# EAGLE design BiphasicBoardv2 (EAGLE 6.5.0)
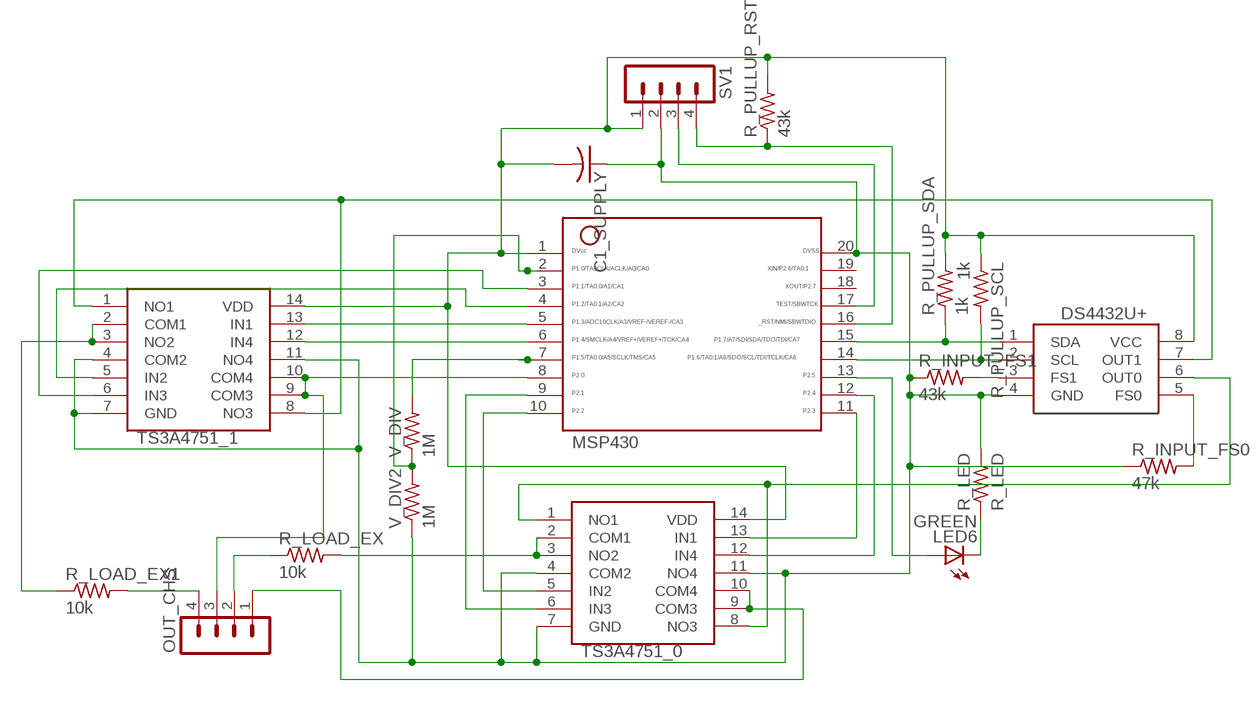
[diagram p0: schematic, sheet 1]

## Parts
C1_SUPPLY  C-USC0603  [C0603]
DS4432U+  DS4432U+  [8_PIN]
LED6  GREEN  LED1206  [LED-1206]
MSP430  MSP430  [20_PIN]
OUT_CHS  MA04-1  [MA04-1]
R_INPUT_FS0  47k  R-US_R0603  [R0603]
R_INPUT_FS1  43k  R-US_R0603  [R0603]
R_LED  R_LED  R-US_R0603  [R0603]
R_LOAD_EX  10k  R-US_R0603  [R0603]
R_LOAD_EX1  10k  R-US_R0603  [R0603]
R_PULLUP_RST  43k  R-US_R0603  [R0603]
R_PULLUP_SCL  1k  R-US_R0603  [R0603]
R_PULLUP_SDA  1k  R-US_R0603  [R0603]
SV1  MA04-1  [MA04-1]
TS3A4751_0  TS3A4751  [14_PIN]
TS3A4751_1  TS3A4751  [14_PIN]
V_DIV  1M  R-US_R0603  [R0603]
V_DIV2  1M  R-US_R0603  [R0603]

## Nets
_RST: MSP430.16 R_PULLUP_RST.1 SV1.4
CURRENT0: DS4432U+.6(OUT0) TS3A4751_0.1(NO1) TS3A4751_0.8(NO3)
DAC_OUT1: DS4432U+.7(OUT1) TS3A4751_1.1(NO1) TS3A4751_1.8(NO3)
GND: C1_SUPPLY.1 DS4432U+.4(GND) MSP430.20 R_INPUT_FS0.1 R_INPUT_FS1.1 R_LED.2 SV1.2 TS3A4751_0.4(COM2) TS3A4751_0.7(GND) TS3A4751_0.11(NO4) TS3A4751_1.4(COM2) TS3A4751_1.7(GND) TS3A4751_1.11(NO4) V_DIV2.1
IN1: MSP430.11 TS3A4751_0.13(IN1)
IN1_1: MSP430.5 TS3A4751_1.13(IN1)
IN2_0: MSP430.10 TS3A4751_0.5(IN2)
IN2_1: MSP430.4 TS3A4751_1.5(IN2)
IN3_0: MSP430.9 TS3A4751_0.6(IN3)
IN3_1: MSP430.3 TS3A4751_1.6(IN3)
IN4: MSP430.12 TS3A4751_0.12(IN4)
IN4_1: MSP430.6 TS3A4751_1.12(IN4)
LOAD1_0: R_LOAD_EX.2 TS3A4751_0.2(COM1) TS3A4751_0.3(NO2)
LOAD1_1: R_LOAD_EX1.1 TS3A4751_1.2(COM1) TS3A4751_1.3(NO2)
LOAD2_0: OUT_CHS.1 TS3A4751_0.9(COM3) TS3A4751_0.10(COM4)
LOAD2_1: MSP430.8 OUT_CHS.3 TS3A4751_1.9(COM3) TS3A4751_1.10(COM4)
N$1: DS4432U+.2(SCL) MSP430.14 R_PULLUP_SCL.2
N$2: DS4432U+.1(SDA) MSP430.15 R_PULLUP_SDA.1
N$3: OUT_CHS.4 R_LOAD_EX1.2
N$4: OUT_CHS.2 R_LOAD_EX.1
N$5: LED6.A MSP430.13
N$6: MSP430.7 V_DIV.2
N$7: MSP430.2 V_DIV2.2 V_DIV.1
N$8: DS4432U+.5(FS0) R_INPUT_FS0.2
N$9: LED6.C R_LED.1
TEST: MSP430.17 SV1.3
VDD: C1_SUPPLY.2 DS4432U+.8(VCC) MSP430.1 R_PULLUP_RST.2 R_PULLUP_SCL.1 R_PULLUP_SDA.2 SV1.1 TS3A4751_0.14(VDD) TS3A4751_1.14(VDD)
VIA1: DS4432U+.3(FS1) R_INPUT_FS1.2
Unconnected: MSP430.18 MSP430.19

## Library data of the parts
C1_SUPPLY = resistor:C-US: CAPACITOR, American symbol
DS4432U+ = BiphasicBoard:DS4432U+: DS4432U+ current DAC
LED6 = SparkFun-LED:LED: LEDs Standard schematic elements and footprints for 5mm, 3mm, 1206, and 0603 sized LEDs. 5mm - Spark Fun Electronics SKU : COM-00529 (and others)
MSP430 = BiphasicBoard:MSP430: MSP430 20 pins
OUT_CHS SV1 = BiphasicBoard:MA04-1: PIN HEADER; OC_FARNELL: unknown; OC_NEWARK: unknown
R_INPUT_FS0 R_INPUT_FS1 R_LED R_LOAD_EX R_LOAD_EX1 R_PULLUP_RST R_PULLUP_SCL R_PULLUP_SDA V_DIV V_DIV2 = BiphasicBoard:R-US_: RESISTOR, American symbol
TS3A4751_0 TS3A4751_1 = BiphasicBoard:TS3A4751: TS3A4751 Quad Switch

## Board
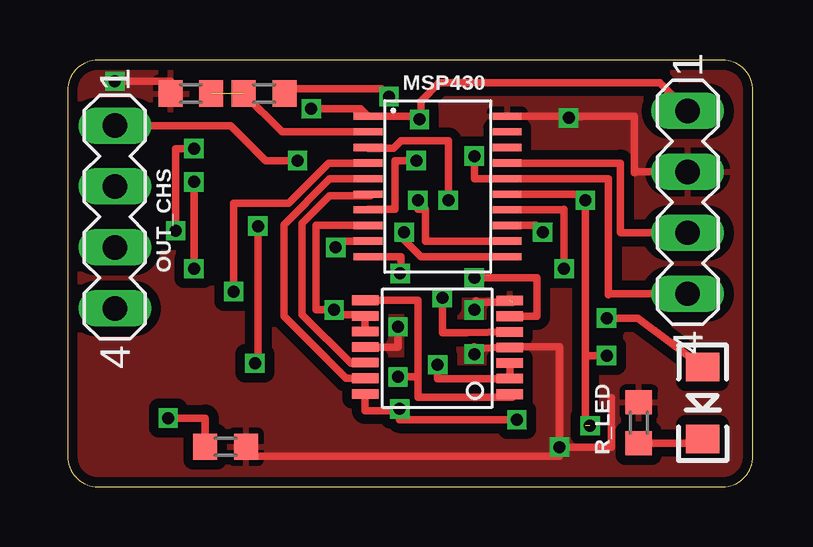
[diagram p1: board, top side]
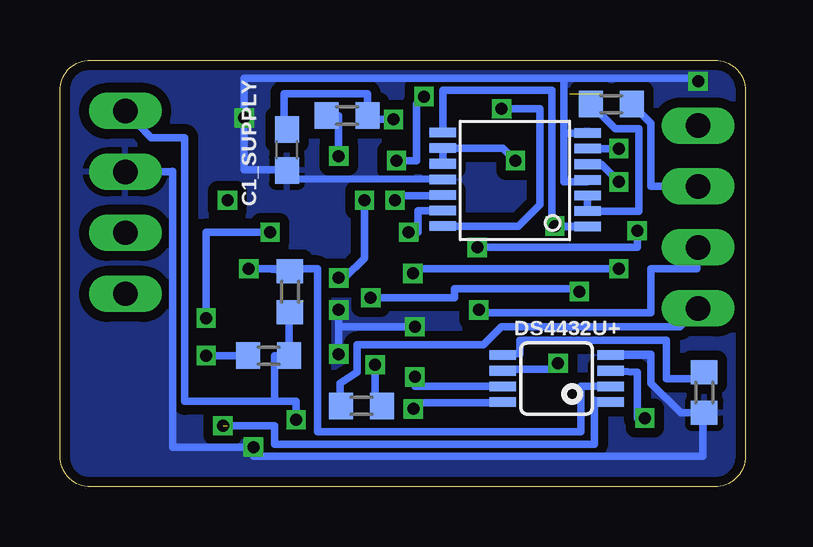
[diagram p2: board, bottom side, seen from below]

Size 28.57 x 17.78 mm. Coordinates in mm from the lower left corner, seen from the top.
Outline: 0,16.51 0,1.27 arc90 1.27,0 27.3,0 arc90 28.57,1.27 28.57,16.51 arc90 27.3,17.78 1.27,17.78 arc90 0,16.51
Copper layers (1*16): Top 0.035mm / dielectric 1.5mm / Bottom 0.035mm
Design rules "Seeed_DRU": minimum track width 6mil, minimum drill 12mil, track to track 6mil, track to pad 6mil, pad to pad 6mil, via to via 6mil, smd to smd 0mil, copper to edge 10mil, drill to drill 10mil, minimum pad ring 10mil, minimum via ring 6mil, stop-mask expansion 2mil, vias tented up to drill 100mil, thermal gap 10mil

### Footprints (pad centres in the part's own frame; a part is rotated, then mirrored left to right if it is on the bottom)
C0603 = smd 1.1 x 1: 1 -0.85,0; 2 0.85,0
8_PIN = smd 1.1 x 0.4: 1 -2.25,0.975; 2 -2.25,0.325; 3 -2.25,-0.325; 4 -2.25,-0.975; 5 2.25,-0.975; 6 2.25,-0.325; 7 2.25,0.325; 8 2.25,0.975
LED-1206 = smd 1.2 x 1.4: A -1.5,0; C 1.5,0
20_PIN = smd 0.3 x 1.2: 1 -2.925,-2.9; 2 -2.275,-2.9; 3 -1.625,-2.9; 4 -0.975,-2.9; 5 -0.325,-2.9; 6 0.325,-2.9; 7 0.975,-2.9; 8 1.625,-2.9; 9 2.275,-2.9; 10 2.925,-2.9; 11 2.925,2.9; 12 2.275,2.9; 13 1.625,2.9; 14 0.975,2.9; 15 0.325,2.9; 16 -0.325,2.9; 17 -0.975,2.9; 18 -1.625,2.9; 19 -2.275,2.9; 20 -2.925,2.9
MA04-1 = drill 1.016 long: 1 -3.81,0; 2 -1.27,0; 3 1.27,0; 4 3.81,0
R0603 = smd 1 x 1.1: 1 -0.85,0; 2 0.85,0
14_PIN = smd 1.1 x 0.4: 1 -3.26,1.165; 2 -3.26,0.515; 3 -3.26,-0.135; 4 -3.26,-0.785; 5 -3.26,-1.435; 6 -3.26,-2.085; 7 -3.26,-2.735; 8 2.77,-2.755; 9 2.77,-2.105; 10 2.77,-1.455; 11 2.77,-0.805; 12 2.77,-0.155; 13 2.77,0.495; 14 2.77,1.145

### Placement (x,y rotation side)
C1_SUPPLY  19.11,14.03 90 bottom
DS4432U+  7.87,4.51 180 bottom
LED6  26.48,3.49 270 top
MSP430  15.43,12.51 270 top
OUT_CHS  1.97,11.24 270 top
R_INPUT_FS0  1.72,3.92 90 bottom
R_INPUT_FS1  6.59,1.67 180 top
R_LED  23.81,2.67 90 top
R_LOAD_EX  5.59,15.94 180 bottom
R_LOAD_EX1  16,3.37 180 bottom
R_PULLUP_RST  16.61,15.47 0 bottom
R_PULLUP_SCL  18.99,8.13 90 bottom
R_PULLUP_SDA  19.88,5.46 0 bottom
SV1  25.85,11.85 270 top
TS3A4751_0  9.84,12 180 bottom
TS3A4751_1  15.18,5.02 180 top
V_DIV  8.19,16.38 0 top
V_DIV2  5.14,16.38 0 top

### Tracks (layer width: path | path; a pad name or v marks a point on that pad's centre or on a via)
_RST  (via drill 0.5)
  Top 0.305: v16.95,13.78 16.95,12.83 MSP430.16 22.54,12.84 22.54,8 22.58,8.04 SV1.4
  Bottom 0.305: R_PULLUP_RST.1 16.95,15.47 v16.95,13.78
CURRENT0  (via drill 0.5)
  Top 0.305: v7.94,10.86 7.94,5.14 v7.81,5.14
  Bottom 0.305: v7.94,10.86 8.06,10.86 8.06,16.51 12.61,16.51 TS3A4751_0.8 12.68,14.73 | v7.94,10.86 6.58,10.86 | v7.81,5.14 7.94,4.89 9.81,4.89 DS4432U+.6 | TS3A4751_0.1 7.94,10.84 v7.94,10.86
DAC_OUT1  (via drill 0.5)
  Top 0.305: 18.48,3.87 18.54,3.72 14.61,3.72 14.61,4.57 | 14.61,4.57 14.61,7.77 TS3A4751_1.8 12.38,7.77 12.38,7.81 | v13.78,4.57 14.61,4.57
  Top 0.406: TS3A4751_1.1 18.48,3.87
  Bottom 0.305: DS4432U+.7 13.78,4.18 v13.78,4.57
GND  (via drill 0.5)  (1 unrouted)
  Top 0.305: 16.95,5.78 TS3A4751_1.4 18.44,5.84 20.51,5.84 v20.51,1.65 | v16.95,5.52 16.83,5.67 | v16.95,7.37 17.02,7.37 17.02,7.68 | 17.02,7.68 18.56,7.68 | MSP430.20 21.72,15.43 | R_INPUT_FS1.1 7.43,1.54 7.43,1.27 20.51,1.27 v20.51,1.65 | v13.78,6.67 13.78,5.82 TS3A4751_1.11 | 21.72,15.43 23.62,15.43 23.62,13.08 23.66,13.12 SV1.2 | 21.72,15.43 v20.89,15.37 | 17.02,7.68 17.02,7.75 | v20.51,1.65 22.67,1.65 22.67,3.71 | V_DIV2.1 4.29,16.89 v1.97,16.89
  Top 0.406: 16.95,5.78 v16.95,5.52
  Bottom 0.305: 16.95,6.67 v16.95,7.37 | 4.06,5.52 5.62,5.52 DS4432U+.4 4.06,5.48 4.06,5.52 | v13.78,6.67 16.95,6.67 | 16.95,6.67 v16.95,5.52 | 1.78,3.11 1.72,3.11 R_INPUT_FS0.1 2.69,3.07 3.94,4.32 3.94,5.52 4.06,5.52 | TS3A4751_0.7 7.56,14.74 | TS3A4751_0.4 6.58,12.7 7.56,12.7 7.56,14.74 | TS3A4751_0.11 12.51,12.81 18.86,12.83 19.24,12.89 C1_SUPPLY.1 | C1_SUPPLY.1 18.99,13.21 20.89,13.21 v20.89,15.37 20.89,17.02 7.56,17.02 | 1.78,3.11 1.78,3.17 | 1.78,3.11 1.78,1.27 20.51,1.27 v20.51,1.65 23.88,1.65 23.88,13.12 | 7.56,14.74 7.56,17.02 | 19.18,13.21 C1_SUPPLY.1 | 23.88,13.14 23.88,13.12 | 23.88,13.12 SV1.2 | v1.97,16.89 1.97,17.02 7.56,17.02
  pour Top (isolate 0.406): -0.06,17.84 28.57,17.78 28.57,-0.06 0,0
  pour Bottom (isolate 0.406): -0.06,17.84 28.57,17.78 28.57,-0.06 0,0
IN1  (via drill 0.5)
  Top 0.305: v14.03,10.6 14.03,10.29 14.73,9.59 MSP430.11
  Bottom 0.305: TS3A4751_0.13 13.65,11.51 13.65,10.6 v14.03,10.6
IN1_1
  Top 0.305: MSP430.5 10.93,12.84 9.02,10.92 9.02,7.11 11.61,4.52 TS3A4751_1.13
IN2_0  (via drill 0.5)
  Top 0.305: v5.27,12.7 v5.27,9.08 | v13.86,8.89 13.91,9.08 13.91,9.59 12.57,9.59 12.64,9.59 MSP430.10
  Bottom 0.305: v5.27,9.08 13.91,9.08 13.91,8.89 v13.86,8.89 | TS3A4751_0.5 6.01,13.44 v5.27,12.7
IN2_1  (via drill 0.5)
  Top 0.305: TS3A4751_1.5 16.66,6.41 15.62,6.41 v15.62,7.87 | v6.92,8.13 6.92,11.81 9.21,11.81 10.88,13.48 MSP430.4
  Bottom 0.305: v6.92,8.13 6.92,8.26 12.13,8.26 12.13,7.87 v15.62,7.87
IN3_0  (via drill 0.5)
  Top 0.305: v5.27,14.09 4.51,14.09 v4.51,10.67 | MSP430.9 11.18,10.23 v11.18,9.97
  Bottom 0.305: TS3A4751_0.6 v5.27,14.09 | v4.51,10.67 4.51,9.97 v11.18,9.97
IN3_1  (via drill 0.5)
  Top 0.305: TS3A4751_1.6 19.56,7.1 19.56,8.7 v16.95,8.7 | v15.88,11.94 15.88,14.41 13.91,14.41 13.59,14.1 12.53,14.1 MSP430.3
  Bottom 0.305: v16.95,8.7 16.7,8.7 15.88,9.53 v15.88,11.94
IN4  (via drill 0.5)
  Top 0.305: v14.61,11.94 14.61,11.56 14.92,11.56 14.92,10.23 MSP430.12
  Bottom 0.305: v14.61,11.94 14.61,12.13 12.61,12.13 TS3A4751_0.12
IN4_1
  Top 0.305: MSP430.6 12.59,12.13 | 12.59,12.13 12.64,12.13 | 12.59,12.13 10.92,12.13 9.78,10.99 9.78,7.18 11.81,5.14 12.38,5.14 TS3A4751_1.12
LOAD1_0
  Bottom 0.305: TS3A4751_0.3 TS3A4751_0.2 4.45,11.49 4.45,14.92 5.42,14.92 R_LOAD_EX.2
LOAD1_1  (via drill 0.5)
  Top 0.305: TS3A4751_1.3 TS3A4751_1.2 15.43,4.5 v15.43,5.08
  Bottom 0.305: R_LOAD_EX1.1 15.43,3.39 v15.43,5.08
LOAD2_0  (via drill 0.5)
  Top 0.305: OUT_CHS.1 6.79,15.05 8.26,13.59 v9.59,13.59
  Bottom 0.305: TS3A4751_0.10 TS3A4751_0.9 10.11,14.11 v9.59,13.59
LOAD2_1  (via drill 0.5)
  Top 0.305: TS3A4751_1.9 TS3A4751_1.10 | 12.41,6.41 TS3A4751_1.10 | v11.11,7.37 11.05,7.18 12.32,7.18 12.41,7.02 TS3A4751_1.10 | MSP430.8 10.35,10.88 10.35,7.37 v11.11,7.37 | 11.18,7.24 v11.11,7.37
  Bottom 0.305: v11.11,7.37 11.11,7.24 | 11.11,7.24 11.18,7.24 | 11.11,7.24 3.94,7.24 3.94,9.08 2.03,9.08 OUT_CHS.3
N$1  (via drill 0.5)
  Top 0.305: MSP430.14 20.53,11.53 20.7,11.56 v20.7,9.08
  Bottom 0.305: DS4432U+.2 6.86,4.18 6.86,2.29 17.84,2.29 17.84,9.08 19.94,9.08 | 19.94,9.08 v20.7,9.08 | 19.94,9.08 R_PULLUP_SCL.2
N$2  (via drill 0.5)  (1 unrouted)
  Top 0.305: MSP430.15 21.59,12.18 v21.59,11.94 21.59,5.46 | 21.59,5.46 21.59,2.54 | v22.48,5.46 21.59,5.46
  Bottom 0.305: DS4432U+.1 6.29,3.6 6.29,1.78 19.62,1.78 19.62,2.54 v21.78,2.54 | 20.83,5.46 R_PULLUP_SDA.1 | 20.83,5.27 20.83,5.46 | 20.83,5.46 v22.48,5.46
N$3
  Bottom 0.305: OUT_CHS.4 2.73,6.67 10.16,6.67 10.92,5.91 16.19,5.91 16.19,4.76 16.89,4.32 16.89,3.4 R_LOAD_EX1.2
N$4
  Bottom 0.305: OUT_CHS.2 3.94,12.51 3.94,15.14 R_LOAD_EX.1
N$5  (via drill 0.5)
  Top 0.305: MSP430.13 19.53,10.88 v19.81,10.6 | v22.48,7.02 23.77,7.02 LED6.A
  Bottom 0.305: v19.81,10.6 22.48,10.6 v22.48,7.02
N$6  (via drill 0.5)
  Top 0.305: MSP430.7 12.53,11.56 13.65,11.56 13.65,13.59 v14.54,13.59 | V_DIV.2 9.08,16.38 9.27,16.57 13.08,16.57 v13.4,16.26
  Bottom 0.305: v13.4,16.26 13.72,15.94 13.72,13.59 v14.54,13.59
N$7  (1 unrouted)
  Top 0.305: V_DIV.1 8.94,14.78 MSP430.2
N$8
  Bottom 0.305: DS4432U+.5 9.4,5.55 9.4,6.1 3.3,6.1 3.3,4.51 1.84,4.51 R_INPUT_FS0.2
N$9
  Top 0.305: LED6.C 26.48,1.82 R_LED.1
TEST
  Top 0.305: MSP430.17 23.05,13.48 23.05,10.6 23.07,10.58 SV1.3
VDD  (via drill 0.5)
  Top 0.305: 13.84,3.17 13.84,2.79 v18.73,2.79 | SV1.1 24.68,16.83 15.49,16.83 14.73,16.07 14.73,15.37 v14.67,15.3 14.63,15.3 14.63,15.43 MSP430.1 12.22,15.75 v10.16,15.75 | TS3A4751_1.14 12.41,3.17 13.84,3.17 | v13.84,3.24 13.84,3.17
  Bottom 0.305: 19.62,3.56 19.62,5.46 R_PULLUP_SDA.2 19.03,7.41 R_PULLUP_SCL.1 | SV1.1 24.77,14.54 23.37,14.54 23.37,3.56 19.62,3.56 | v14.67,15.3 15.88,15.3 15.76,15.42 R_PULLUP_RST.2 15.76,16.38 19.24,16.38 19.24,14.88 C1_SUPPLY.2 | DS4432U+.8 10.12,3.49 13.84,3.49 v13.84,3.24 | v18.73,2.79 18.73,3.56 19.62,3.56 | v10.16,15.75 8.57,15.75 8.57,11.75 9.46,10.86 TS3A4751_0.14
VIA1  (via drill 0.5)
  Top 0.305: v4.19,2.86 5.74,2.86 R_INPUT_FS1.2
  Bottom 0.305: DS4432U+.3 4.51,4.77 4.51,2.86 v4.19,2.86

### Text on the board
tDocu: VCC | GND | Biphasic v1.3